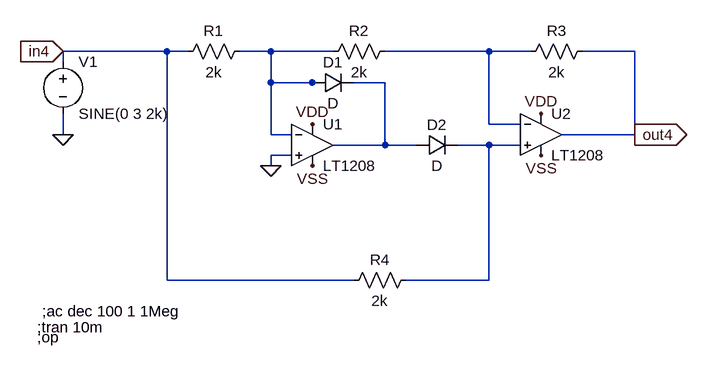
[diagram p0: schematic Etaj4.asc]
Etaj4.asc, the LTspice schematic file:
Version 4
SHEET 1 880 680
WIRE -144 -64 -304 -64
WIRE -112 -64 -144 -64
WIRE 16 -64 -32 -64
WIRE 112 -64 16 -64
WIRE 352 -64 192 -64
WIRE 416 -64 352 -64
WIRE 576 -64 496 -64
WIRE -304 -48 -304 -64
WIRE 16 -16 16 -64
WIRE 80 -16 16 -16
WIRE 96 -16 80 -16
WIRE 192 -16 144 -16
WIRE 352 48 352 -64
WIRE 400 48 352 48
WIRE -304 64 -304 32
WIRE 16 64 16 -16
WIRE 48 64 16 64
WIRE 576 64 576 -64
WIRE 576 64 464 64
WIRE 192 80 192 -16
WIRE 192 80 112 80
WIRE 240 80 192 80
WIRE 352 80 304 80
WIRE 400 80 352 80
WIRE 48 96 16 96
WIRE 16 112 16 96
WIRE -144 288 -144 -64
WIRE 144 288 -144 288
WIRE 352 288 352 80
WIRE 352 288 224 288
FLAG 16 112 0
FLAG -304 64 0
FLAG 80 48 VDD
FLAG 432 32 VDD
FLAG 80 112 VSS
FLAG 432 96 VSS
FLAG 576 64 out4
IOPIN 576 64 Out
FLAG -304 -64 in4
IOPIN -304 -64 In
SYMBOL OpAmps\\LT1208 80 16 R0
SYMATTR InstName U1
SYMBOL OpAmps\\LT1208 432 0 R0
SYMATTR InstName U2
SYMBOL res -16 -80 R90
WINDOW 0 0 56 VBottom 2
WINDOW 3 32 56 VTop 2
SYMATTR InstName R1
SYMATTR Value 2k
SYMBOL res 208 -80 R90
WINDOW 0 0 56 VBottom 2
WINDOW 3 32 56 VTop 2
SYMATTR InstName R2
SYMATTR Value 2k
SYMBOL res 512 -80 R90
WINDOW 0 0 56 VBottom 2
WINDOW 3 32 56 VTop 2
SYMATTR InstName R3
SYMATTR Value 2k
SYMBOL res 240 272 R90
WINDOW 0 0 56 VBottom 2
WINDOW 3 32 56 VTop 2
SYMATTR InstName R4
SYMATTR Value 2k
SYMBOL voltage -304 -64 R0
WINDOW 123 0 0 Left 0
WINDOW 39 0 0 Left 0
SYMATTR InstName V1
SYMATTR Value SINE(0 3 2k)
SYMBOL diode 80 0 R270
WINDOW 0 32 32 VTop 2
WINDOW 3 0 32 VBottom 2
SYMATTR InstName D1
SYMBOL diode 240 96 R270
WINDOW 0 32 32 VTop 2
WINDOW 3 0 32 VBottom 2
SYMATTR InstName D2
TEXT -336 336 Left 2 !;ac dec 100 1 1Meg
TEXT -344 360 Left 2 !;tran 10m
TEXT -344 376 Left 2 !;op

The netlist it stands for:
* Etaj4.asc
XU1 0 N001 VDD VSS N003 LT1208  ; pins In+ In- V+ V- OUT
XU2 N004 N002 VDD VSS out4 LT1208  ; pins In+ In- V+ V- OUT
R1 N001 in4 2k
R2 N002 N001 2k
R3 out4 N002 2k
R4 N004 in4 2k
V1 in4 0 SINE(0 3 2k)
D1 N001 N003 D
D2 N003 N004 D
.model D D
.lib standard.dio
;ac dec 100 1 1Meg
;tran 10m
;op
.backanno
.end